# Altium project Power_Rail_Probe.PrjPcb
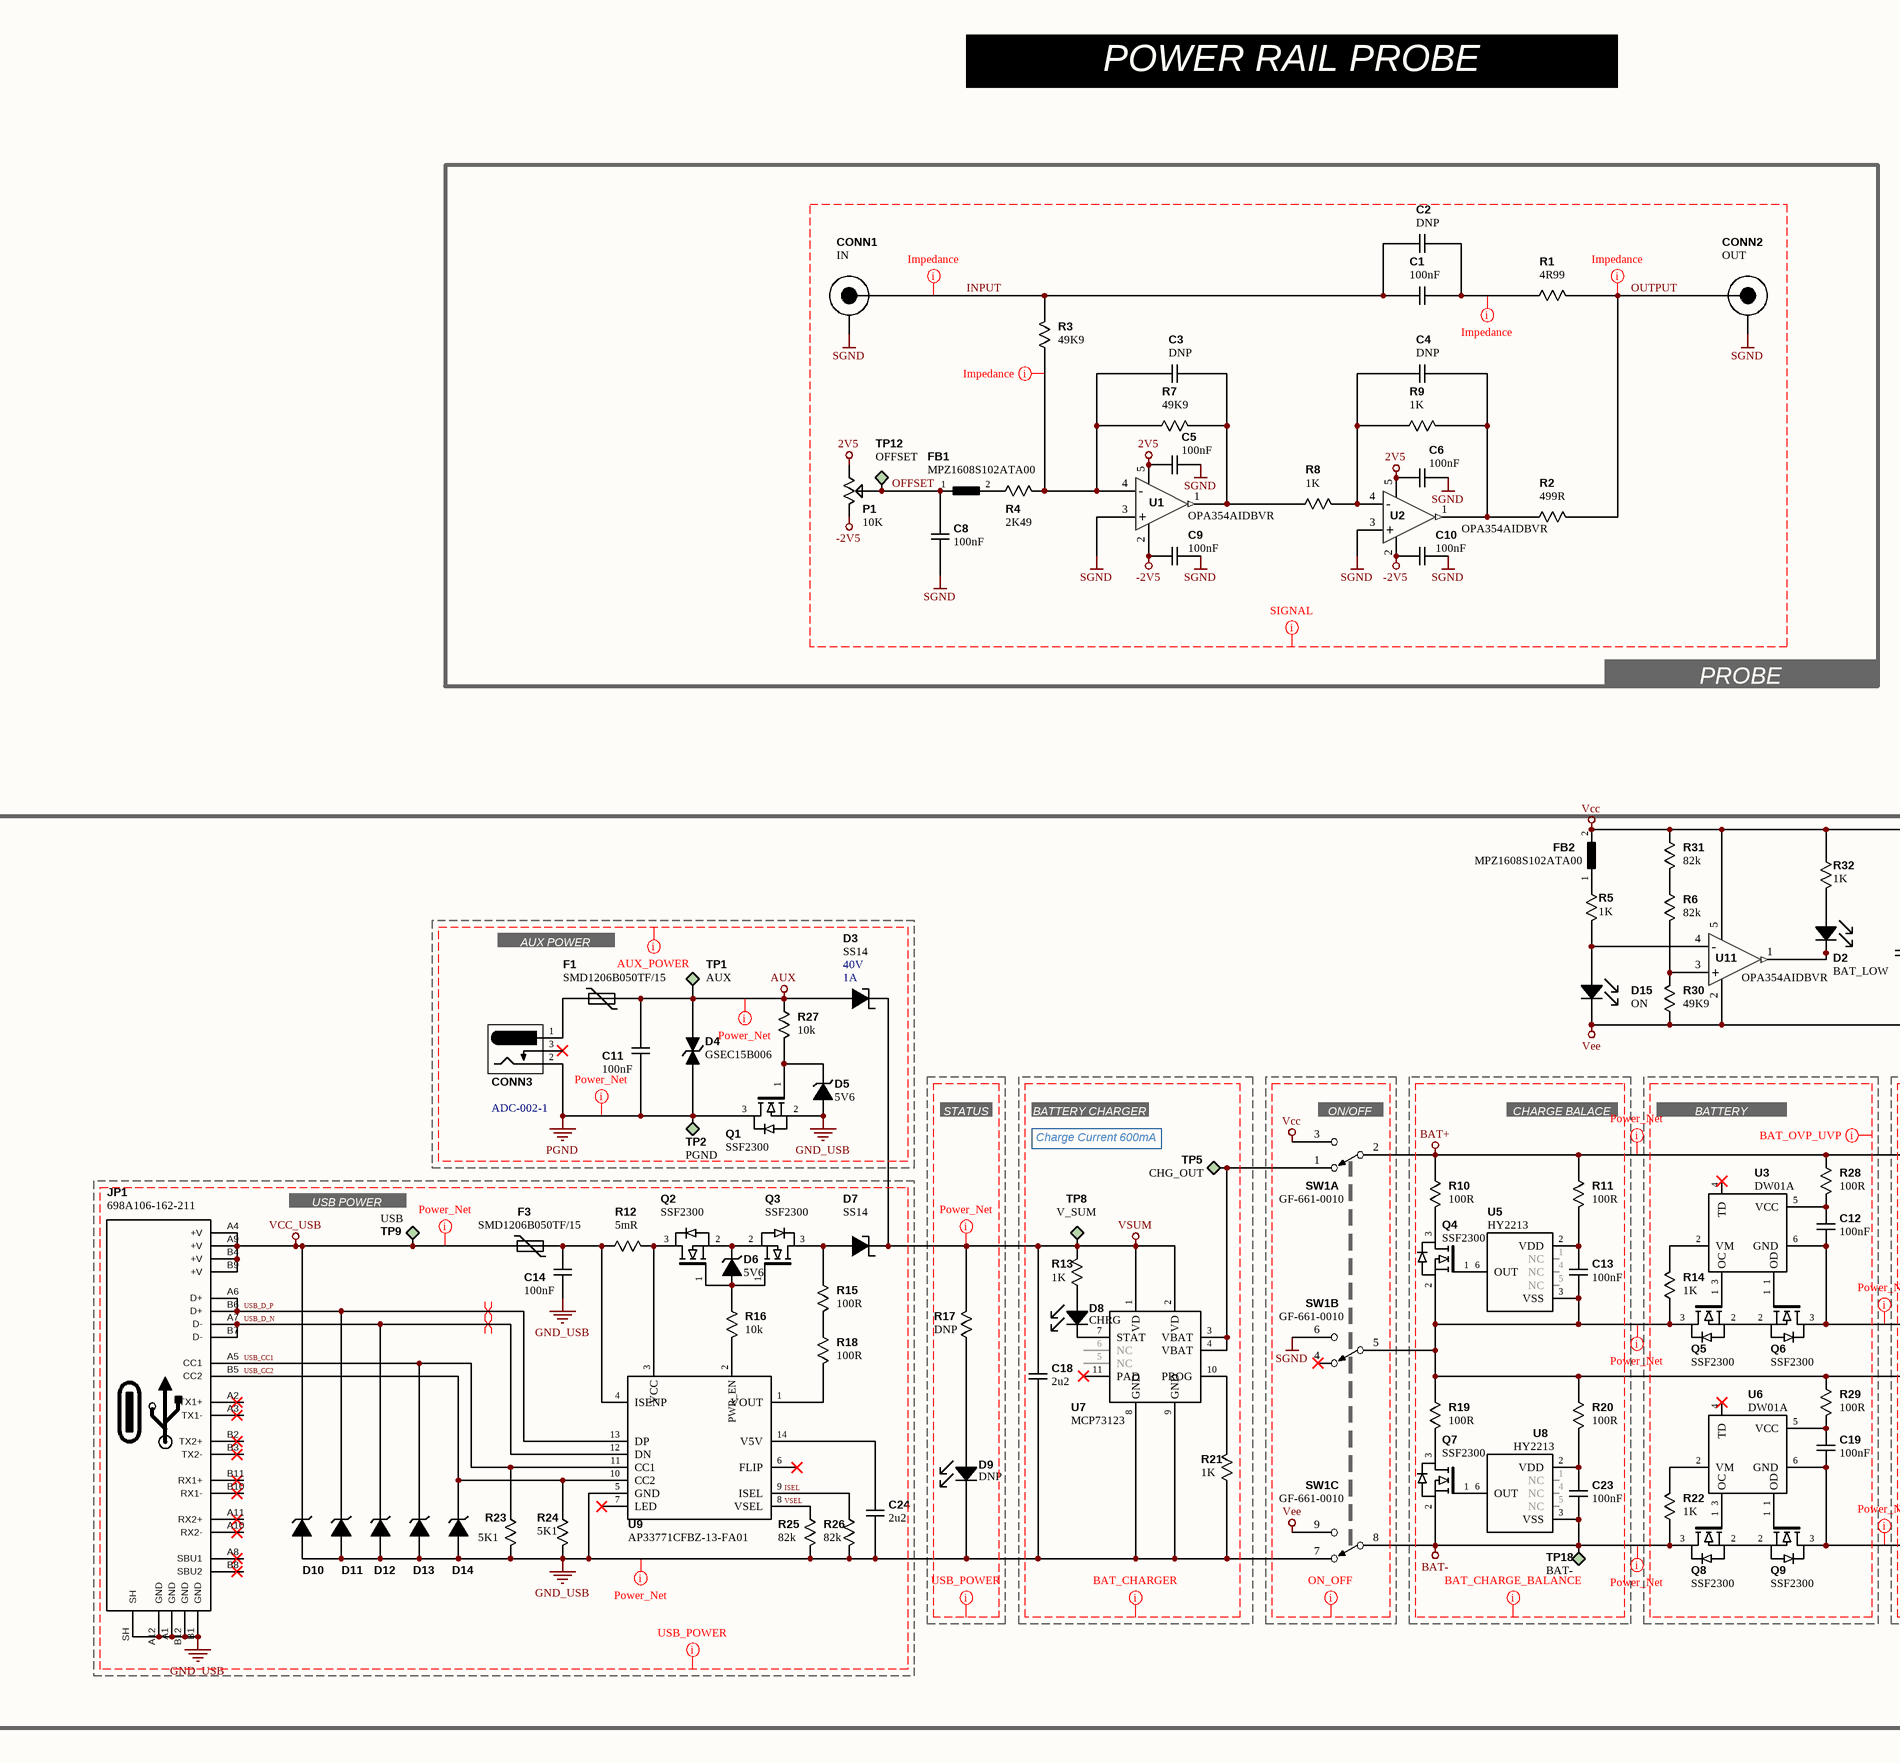
[diagram p0: Power_Rail_Probe.SchDoc, left]
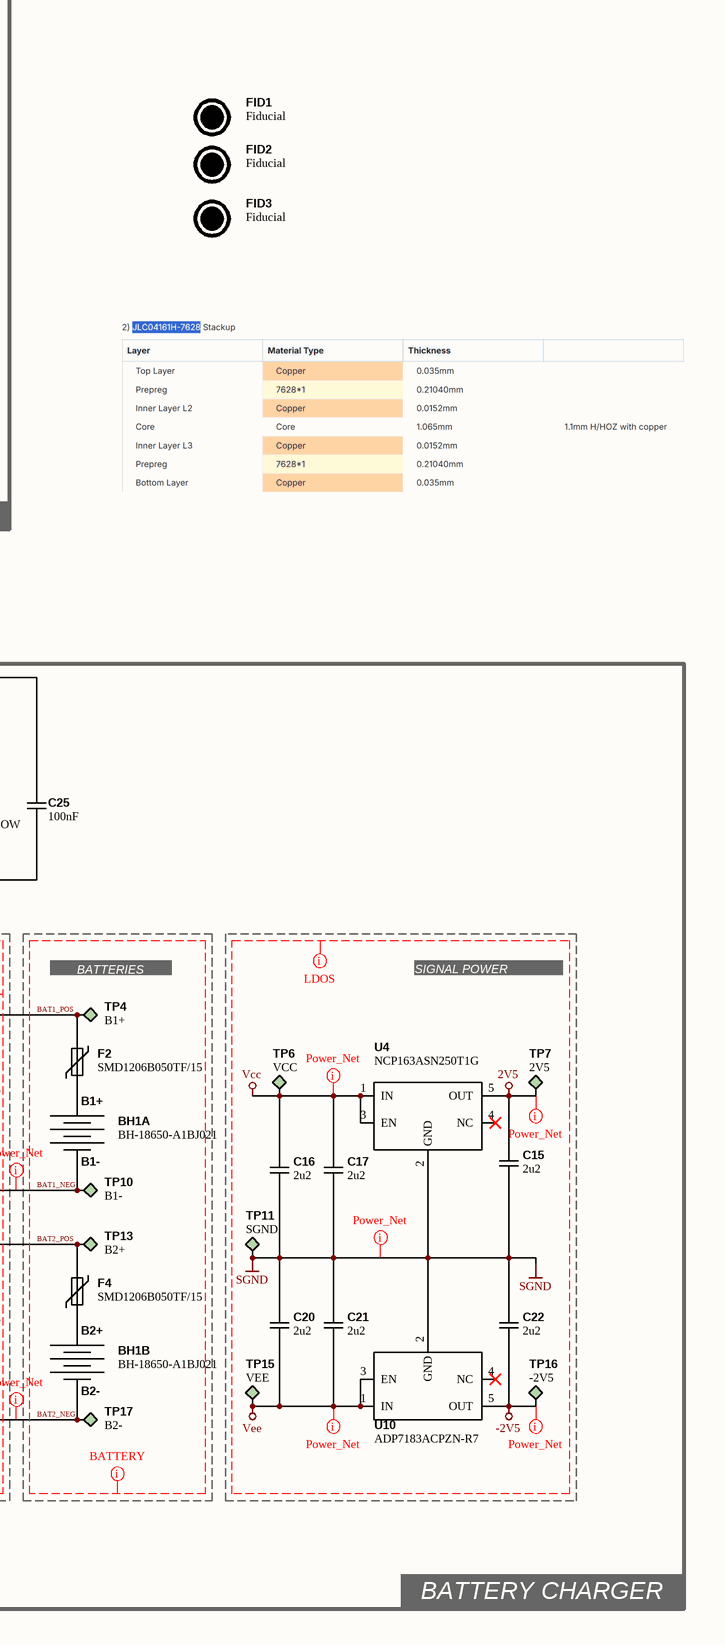
[diagram p1: Power_Rail_Probe.SchDoc, right]
1 sheet, 122 parts. Net scope: global (net labels, ports and power ports of the same name join across sheets).
Board file: Power_Rail_Probe.PcbDoc

## Sheet Power_Rail_Probe.SchDoc
size A2; SheetNumber: 1; SheetTotal: 1

### Parts
BH1  BH-18650-A1BJ021  [BH-18650-A1BJ021]  (parts A,B of 2)
C1  100nF  [CAP_SMD_1206]
C2  DNP  [CAP_SMD_0603]
C3  DNP  [CAP_SMD_0603]
C4  DNP  [CAP_SMD_0603]
C5  100nF  [CAP_SMD_0603]
C6  100nF  [CAP_SMD_0603]
C8  100nF  [CAP_SMD_0603]
C9  100nF  [CAP_SMD_0603]
C10  100nF  [CAP_SMD_0603]
C11  100nF  [CAP_SMD_0603]
C12  100nF  [CAP_SMD_0603]
C13  100nF  [CAP_SMD_0603]
C14  100nF  [CAP_SMD_0603]
C15  2u2  [CAP_SMD_0805]
C16  2u2  [CAP_SMD_0805]
C17  2u2  [CAP_SMD_0805]
C18  2u2  [CAP_SMD_0805]
C19  100nF  [CAP_SMD_0603]
C20  2u2  [CAP_SMD_0805]
C21  2u2  [CAP_SMD_0805]
C22  2u2  [CAP_SMD_0805]
C23  100nF  [CAP_SMD_0603]
C24  2u2  [CAP_SMD_0805]
C25  100nF  [CAP_SMD_0603]
CONN1  IN  [CONBNC002]
CONN2  OUT  [CONBNC002]
CONN3  04_Manufacturer Part Number: ADC-002-1  [ADC-002A]  (hidden comment: AUX)
D2  BAT_LOW  [LED_0603_1608]
D3  SS14  07_Tensión: 40V  08_Corriente: 1A  [DO_214_AC]
D4  GSEC15B006  [SOD_323]
D5  5V6  [SOD_323]
D6  5V6  [SOD_323]
D7  SS14  [DO_214_AC]
D8  CHRG  [LED_0603_1608]
D9  DNP  [LED_0603_1608]
D10  GSEC15B006  [SOD_323]  (value not drawn)
D11  GSEC15B006  [SOD_323]  (value not drawn)
D12  GSEC15B006  [SOD_323]  (value not drawn)
D13  GSEC15B006  [SOD_323]  (value not drawn)
D14  GSEC15B006  [SOD_323]  (value not drawn)
D15  ON  [LED_0603_1608]
F1  SMD1206B050TF/15  [RES_SMD_1210]
F2  SMD1206B050TF/15  [RES_SMD_1210]
F3  SMD1206B050TF/15  [RES_SMD_1210]
F4  SMD1206B050TF/15  [RES_SMD_1210]
FB1  MPZ1608S102ATA00  [FERRITE_SMD_0603]
FB2  MPZ1608S102ATA00  [FERRITE_SMD_0603]
FID1  Fiducial  [Fiducial]  (no BOM)
FID2  Fiducial  [Fiducial]  (no BOM)
FID3  Fiducial  [Fiducial]  (no BOM)
JP1  698A106-162-211  [1054500101]
P1  10K  [POTENCIOMETRO_RK09K1110A0J]
Q1  SSF2300  [SOT_23-3]
Q2  SSF2300  [SOT_23-3]
Q3  SSF2300  [SOT_23-3]
Q4  SSF2300  [SOT_23-3]
Q5  SSF2300  [SOT_23-3]
Q6  SSF2300  [SOT_23-3]
Q7  SSF2300  [SOT_23-3]
Q8  SSF2300  [SOT_23-3]
Q9  SSF2300  [SOT_23-3]
R1  4R99  [RES_SMD_0603]
R2  499R  [RES_SMD_0603]
R3  49K9  [RES_SMD_0603]
R4  2K49  [RES_SMD_0603]
R5  1K  [RES_SMD_0603]
R6  82k  [RES_SMD_0603]
R7  49K9  [RES_SMD_0603]
R8  1K  [RES_SMD_0603]
R9  1K  [RES_SMD_0603]
R10  100R  [RES_SMD_0603]
R11  100R  [RES_SMD_0603]
R12  5mR  [RES_SMD_0805]
R13  1K  [RES_SMD_0603]
R14  1K  [RES_SMD_0603]
R15  100R  [RES_SMD_0603]
R16  10k  [RES_SMD_0603]
R17  DNP  [RES_SMD_0603]
R18  100R  [RES_SMD_0603]
R19  100R  [RES_SMD_0603]
R20  100R  [RES_SMD_0603]
R21  1K  [RES_SMD_0603]
R22  1K  [RES_SMD_0603]
R23  5K1  [RES_SMD_0603]
R24  5K1  [RES_SMD_0603]
R25  82k  [RES_SMD_0603]
R26  82k  [RES_SMD_0603]
R27  10k  [RES_SMD_0603]
R28  100R  [RES_SMD_0603]
R29  100R  [RES_SMD_0603]
R30  49K9  [RES_SMD_0603]
R31  82k  [RES_SMD_0603]
R32  1K  [RES_SMD_0603]
SW1  GF-661-0010  [1003P1T2B1M2QEH]  (parts A,B,C of 3)
TP1  AUX  [Test_Point_THT]  (no BOM)
TP2  PGND  [Test_Point_THT]  (no BOM)
TP4  B1+  [Test_Point_SMD]  (no BOM)
TP5  CHG_OUT  [Test_Point_THT]  (no BOM)
TP6  VCC  [Test_Point_THT]  (no BOM)
TP7  2V5  [Test_Point_THT]  (no BOM)
TP8  V_SUM  [Test_Point_THT]  (no BOM)
TP9  USB  [Test_Point_THT]  (no BOM)
TP10  B1-  [Test_Point_SMD]  (no BOM)
TP11  SGND  [Test_Point_THT]  (no BOM)
TP12  OFFSET  [Test_Point_THT]  (no BOM)
TP13  B2+  [Test_Point_SMD]  (no BOM)
TP15  VEE  [Test_Point_THT]  (no BOM)
TP16  -2V5  [Test_Point_THT]  (no BOM)
TP17  B2-  [Test_Point_SMD]  (no BOM)
TP18  BAT-  [Test_Point_THT]  (no BOM)
U1  OPA354AIDBVR  [SOT_23-5]
U2  OPA354AIDBVR  [SOT_23-5]
U3  DW01A  [SOT_23-6]
U4  NCP163ASN250T1G  [SOT_23-5]
U5  HY2213  [SOT_23-6]
U6  DW01A  [SOT_23-6]
U7  MCP73123  [DFN_10]
U8  HY2213  [SOT_23-6]
U9  AP33771CFBZ-13-FA01  [DFN_14]
U10  ADP7183ACPZN-R7  [SOT_23-5]
U11  OPA354AIDBVR  [SOT_23-5]

### Nets
2V5: C5.1 C6.1 C15.2 P1.3 TP7.1 U1.5(VCC) U2.5(VCC) U4.5(OUT)
-2V5: C9.1 C10.1 C22.1 P1.1 TP16.1 U1.2(GND) U2.2(GND) U10.5(OUT)
AUX: C11.2 D3.A D4.K F1.1 R27.2 TP1.1
BAT1_POS: F2.2 R10.2 R11.2 R28.2 SW1.2(COM1) TP4.1  [also labelled BAT+]
BAT-: C23.1 Q7.2(S) Q8.3(D) R22.1 SW1.8(COM3) TP18.1 U8.3(VSS)
GND_USB: C14.1 C18.1 C24.1 D5.A D9.K D10.A D11.A D12.A D13.A D14.A JP1.A1(GND) JP1.A12(GND) JP1.B1(GND) JP1.B12(GND) JP1.SH Q1.2(S) R21.1 R23.1 R24.1 R25.1 R26.1 SW1.7(NC3) U7.8(GND) U7.9(GND) U9.5(GND)
PGND: C11.1 CONN3.2 D4.A Q1.3(D) TP2.1
SGND: C5.2 C6.2 C8.1 C9.2 C10.2 C15.1 C16.1 C17.1 C20.2 C21.2 C22.2 CONN1.2 CONN2.2 SW1.6(NO2) TP11.1 U1.3(+) U2.3(+) U4.2(GND) U10.2(GND)
Vcc: C16.2 C17.2 C25.1 FB2.2 R31.2 R32.1 SW1.3(NO1) TP6.1 U4.1(IN) U4.3(EN) U11.5(VCC)
VCC_USB: D10.K F3.2 JP1.A4(+V) JP1.A9(+V) JP1.B4(+V) JP1.B9(+V) TP9.1
Vee: C20.1 C21.1 C25.2 D15.K R30.1 SW1.9(NO3) TP15.1 U10.1(IN) U10.3(EN) U11.2(GND)
VSUM: C18.2 D3.K D7.K R13.2 R17.2 TP8.1 U7.1(VD) U7.2(VD)
BAT1_NEG: BH1.N1 C12.1 Q6.3(D) TP10.1 U3.6(GND)
BAT2_NEG: BH1.N2(B2-) C19.1 Q9.3(D) TP17.1 U6.6(GND)
BAT2_POS: C13.1 F4.2 Q4.2(S) Q5.3(D) R14.1 R19.2 R20.2 R29.2 SW1.5(COM2) TP13.1 U5.3(VSS)
INPUT: C1.1 C2.2 CONN1.1(SIGNAL) R3.2
OFFSET: C8.2 FB1.1 P1.2 TP12.1
OUTPUT: CONN2.1(SIGNAL) R1.2 R2.2
USB_CC1: D13.K JP1.A5(CC1) R23.2 U9.11(CC1)
USB_CC2: D14.K JP1.B5(CC2) R24.2 U9.10(CC2)
USB_D_N: D12.K JP1.A7(D-) JP1.B7(D-) U9.12(DN)
USB_D_P: D11.K JP1.A6(D+) JP1.B6(D+) U9.13(DP)
NetBH1_P1: BH1.P1(B+) F2.1
NetBH1_P2: BH1.P2(B2+) F4.1
NetC1_2: C1.2 C2.1 R1.1
NetC3_1: C3.1 R7.2 R8.1 U1.1(OUT)
NetC3_2: C3.2 R3.1 R4.2 R7.1 U1.4(-)
NetC4_1: C4.1 R2.1 R9.2 U2.1(OUT)
NetC4_2: C4.2 R8.2 R9.1 U2.4(-)
NetC12_2: C12.2 R28.1 U3.5(VCC)
NetC13_2: C13.2 R11.1 U5.2(VDD)
NetC14_2: C14.2 F3.1 R12.2 U9.4(ISENP)
NetC19_2: C19.2 R29.1 U6.5(VCC)
NetC23_2: C23.2 R20.1 U8.2(VDD)
NetC24_2: C24.2 U9.14(V5V)
NetCONN3_1: CONN3.1(SIGNAL) F1.2
NetD2_A: D2.A R32.2
NetD2_K: D2.K U11.1(OUT)
NetD5_K: D5.K Q1.1(G) R27.1
NetD6_A: D6.A Q2.1(G) Q3.1(G) R16.2
NetD6_K: D6.K Q2.2(S) Q3.2(S)
NetD7_A: D7.A Q3.3(D) R15.2
NetD8_A: D8.A R13.1
NetD8_K: D8.K U7.7(STAT)
NetD9_A: D9.A R17.1
NetD15_A: D15.A R5.2 U11.4(-)
NetFB1_2: FB1.2 R4.1
NetFB2_1: FB2.1 R5.1
NetQ2_3: Q2.3(D) R12.1 U9.3(VCC)
NetQ4_1: Q4.1(G) U5.6(OUT)
NetQ4_3: Q4.3(D) R10.1
NetQ5_1: Q5.1(G) U3.3(OC)
NetQ5_2: Q5.2(S) Q6.2(S)
NetQ6_1: Q6.1(G) U3.1(OD)
NetQ7_1: Q7.1(G) U8.6(OUT)
NetQ7_3: Q7.3(D) R19.1
NetQ8_1: Q8.1(G) U6.3(OC)
NetQ8_2: Q8.2(S) Q9.2(S)
NetQ9_1: Q9.1(G) U6.1(OD)
NetR6_1: R6.1 R30.2 U11.3(+)
NetR6_2: R6.2 R31.1
NetR14_2: R14.2 U3.2(VM)
NetR15_1: R15.1 R18.2
NetR16_1: R16.1 U9.2(PWR_EN)
NetR18_1: R18.1 U9.1(VOUT)
NetR21_2: R21.2 U7.10(PROG)
NetR22_2: R22.2 U6.2(VM)
NetR25_2: R25.2 U9.8(VSEL)
NetR26_2: R26.2 U9.9(ISEL)
NetSW1_1: SW1.1(NC1) TP5.1 U7.3(VBAT) U7.4(VBAT)

Not connected (* = marked no-connect by the designer): CONN3 3*; FID1 5; FID2 5; FID3 5; JP1 A2(TX1+)* A3(TX1-)* A8(SBU1)* A10(RX2-)* A11(RX2+)* B2(TX2+)* B3(TX2-)* B8(SBU2)* B10(RX1-)* B11(RX1+)*; SW1 4(NC2)*; U3 4(TD)*; U4 4(NC)*; U5 1(NC) 4(NC) 5(NC); U6 4(TD)*; U7 5(NC) 6(NC) 11(PAD)*; U8 1(NC) 4(NC) 5(NC); U9 6(FLIP)* 7(LED)*; U10 4(NC)*

### Layout directives
differential pair: USB_D_N, USB_D_P
CompClassName: AUX_POWER; net class AUX_POWER: AUX, GND_USB, PGND
CompClassName: USB_POWER; net class USB_POWER: (no net found under the mark), GND_USB, ISEL, USB_CC1, USB_CC2, USB_D_N, USB_D_P, VCC_USB, VSEL
CompClassName: BAT_CHARGER; net class BAT_CHARGER: VSUM
CompClassName: ON_OFF; net class ON_OFF: SGND, Vcc, Vee
CompClassName: BAT_CHARGE_BALANCE; net class BAT_CHARGE_BALANCE: BAT+, BAT-
CompClassName: BAT_OVP_UVP; net class BAT_OVP_UVP: (no net found under the mark)
CompClassName: BATTERY; net class BATTERY: BAT1_NEG, BAT1_POS, BAT2_NEG, BAT2_POS
CompClassName: LDOS; net class LDOS: 2V5, -2V5, SGND, Vcc, Vee
CompClassName: SIGNAL; net class SIGNAL: 2V5, -2V5, INPUT, OFFSET, OUTPUT, SGND
net class Power: 2V5, -2V5, AUX, BAT1_NEG, BAT1_POS, BAT2_NEG, BAT2_POS, BAT-, GND_USB, PGND, SGND, Vcc, VCC_USB, Vee, VSUM
net class 50_Ohm_Tracks: INPUT, NetC1_2, NetC3_2, OUTPUT

### Notes on the sheet
- POWER RAIL PROBE
- PROBE
- AUX POWER
- STATUS
- BATTERY CHARGER
- Charge Current 600mA
- (near SW1) ON/OFF
- CHARGE BALACE
- BATTERY PROTECTION
- (near TP4) BATTERIES
- SIGNAL POWER SUPPLIES
- (near TP9) USB POWER
- Labels drawn without touching a wire or pin: ISEL, VSEL
- (in symbol BH-18650-A1BJ021, part A) B1+; B1-

### Library data of the parts
BH1 = BH-18650-A1BJ021: 2 Cell 18650 Battery Holder; 06_Manufacturer: MYOUNG; 01_Componente: IC; 02_Montaje: THM; 03_Encapsulado: NA; 04_Manufacturer Part Number: BH-18650-A1BJ021; 05_Digikey Part Number: Not Available; 07_Funcion: Battery Holder; ComponentLink1Description: 01_Datasheet; ComponentLink1URL: https://www.lcsc.com/datasheet/C20606804.pdf?spm=wm.sxq.inf.ggs&lcsc_vid=QgdWXldRRVMIVlxRFlhXBFZfRldXX1JXQVQPBlEDEwUxVlNRQ1BfVVJRQ1VZVDsOAxUeFF5JWBYZEEoBGA4JCwFIFA4DSA%3D%3D; ComponentLink2Description: 02_Digikey; ComponentLink2URL: Not Available; ComponentLink3Description: 03_LCSC; ComponentLink3URL: https://www.lcsc.com/product-detail/C20606804.html
C1 = Capacitor NP: 0.1 µF ±2% 50V Ceramic Capacitor C0G, NP0 1206 (3216 Metric); 04_Manufacturer Part Number: GRM3195C1H104GA05D; 06_Manufacturer: YAGEO; 01_Componente: Capacitor cerámico; 02_Montaje: SMD; 03_Encapsulado: 1206; 09_Tensión de trabajo: 100V; 05_Digikey Part Number: 490-GRM3195C1H104GA05DCT-ND; ComponentLink1Description: A_Datasheet; ComponentLink1URL: https://search.murata.co.jp/Ceramy/image/img/A01X/G101/ENG/GRM3195C1H104GA05-01A.pdf; ComponentLink2Description: B_Digikey; ComponentLink2URL: https://www.digikey.com/en/products/detail/murata-electronics/GRM3195C1H104GA05D/13531987; 07_Valor: 100nF; 08_Tolerancia: 2%; 10_Dielectrico: C0G
C2-C4 = Capacitor NP: 0.1 µF ±10% 25V Ceramic Capacitor X7R 0603 (1608 Metric); 04_Manufacturer Part Number: CC0603KRX7R8BB104; 06_Manufacturer: YAGEO; 01_Componente: Capacitor cerámico; 02_Montaje: SMD; 03_Encapsulado: 0603; 07_Valor: 100nF; 05_Digikey Part Number: 311-1341-1-ND; ComponentLink1Description: A_Datasheet; ComponentLink2Description: B_Digikey; 08_Tolerancia: 10%; 09_Tensión de trabajo: 25V; 10_Dielectrico: X7R
  C2 C3: ComponentLink1URL: *; ComponentLink2URL: *
  C4: ComponentLink1URL: https://yageogroup.com/content/datasheet/asset/file/UPY-GPHC_X7R_6_3V-TO-250V; ComponentLink2URL: https://www.digikey.com/en/products/detail/yageo/CC0603KRX7R8BB104/2103079?s=N4IgTCBcDaIMJwAwDZEGYDSAlAGgdiwA4AhYgRkQBYQBdAXyA
C5 C6 C8-C14 C19 C23 C25 = Capacitor NP: 0.1 µF ±10% 25V Ceramic Capacitor X7R 0603 (1608 Metric); 04_Manufacturer Part Number: CC0603KRX7R8BB104; 06_Manufacturer: YAGEO; 01_Componente: Capacitor cerámico; 02_Montaje: SMD; 03_Encapsulado: 0603; 05_Digikey Part Number: 311-1341-1-ND; ComponentLink1Description: A_Datasheet; ComponentLink2Description: B_Digikey; 07_Valor: 100nF; 08_Tolerancia: 10%; 09_Tensión de trabajo: 25V; 10_Dielectrico: X7R
  C5: ComponentLink1URL: https://yageogroup.com/content/datasheet/asset/file/UPY-GPHC_X7R_6_3V-TO-250V; ComponentLink2URL: https://www.digikey.com/en/products/detail/yageo/CC0603KRX7R8BB104/2103079
  C6 C8-C14 C19 C23 C25: ComponentLink1URL: *; ComponentLink2URL: *
C15-C18 C20-C22 C24 = Capacitor NP: 2.2 µF ±10% 25V Ceramic Capacitor X7R 0805 (2012 Metric); 04_Manufacturer Part Number: GRM21BR71E225KE11K; 06_Manufacturer: Murata Electronics; 01_Componente: Capacitor cerámico; 02_Montaje: SMD; 03_Encapsulado: 0805; 05_Digikey Part Number: 490-GRM21BR71E225KE11KCT-ND; ComponentLink1Description: A_Datasheet; ComponentLink2Description: B_Digikey; 07_Valor: 2u2; 08_Tolerancia: 10%; 09_Tensión de trabajo: 25V; 10_Dielectrico: X7R
  C15-C17 C20-C22: ComponentLink1URL: *; ComponentLink2URL: *
  C18 C24: ComponentLink1URL: https://search.murata.co.jp/Ceramy/image/img/A01X/G101/ENG/GRM21BR71E225KE11-01A.pdf; ComponentLink2URL: https://www.digikey.com/en/products/detail/murata-electronics/GRM21BR71E225KE11K/10694460
CONN1 CONN2 = Conector BNC: BNC Connector Jack, Female Socket 50 Ohms Panel Mount, Through Hole, Right Angle Solder; 06_Manufacturer: TE Connectivity Linx; 02_Montaje: SMD; 07_Contactos: 2; 08_Impedancia: 50 Ohm; 01_Componente: Conector BNC; 03_Encapsulado: BNC; 04_Manufacturer Part Number: CONBNC002; 05_Digikey Part Number: 343-CONBNC002-ND; ComponentLink1Description: A_Datasheet; ComponentLink2Description: B_Digikey
  CONN1: ComponentLink1URL: https://www.te.com/commerce/DocumentDelivery/DDEController?Action=srchrtrv&DocNm=CONBNC002&DocType=Data+Sheet&DocLang=English&DocFormat=pdf&PartCntxt=CONBNC002; ComponentLink2URL: https://www.digikey.com/en/products/detail/te-connectivity-linx/CONBNC002/16013841
  CONN2: ComponentLink1URL: *; ComponentLink2URL: *
CONN3 = DC JACK: 06_Manufacturer: Adam Tech; 02_Montaje: THT; 07_Contactos: 3; 01_Componente: DC JACK; 03_Encapsulado: -; 05_Digikey Part Number: 2057-ADC-002-1-ND; ComponentLink1Description: A_Datasheet; ComponentLink1URL: https://app.adam-tech.com/products/download/data_sheet/203725/adc-002-x-data-sheet.pdf; ComponentLink2Description: B_Digikey; ComponentLink2URL: https://www.digikey.com/en/products/detail/adam-tech/ADC-002-1/21710741; 08_Paso: -
D2 D8 D9 D15 = Diodo LED: 04_Manufacturer Part Number: SML-D12U1WT86; 06_Manufacturer: Rohm Semiconductor; 02_Montaje: SMD; 03_Encapsulado: 1608; 01_Componente: Diodo Led; 05_Digikey Part Number: SML-D12U1WT86CT-ND; ComponentLink1Description: A_Datasheet; ComponentLink1URL: https://www.rohm.com/datasheet?p=SML-D12U1W&dist=Digi-key&media=referral&source=digi-key.com&campaign=Digi-key; ComponentLink2Description: B_Digikey; ComponentLink2URL: https://www.digikey.com/en/products/detail/rohm-semiconductor/SML-D12U1WT86/5843853
D3 = Diodo Schottky: Diode 40 V 1A Surface Mount DO-214AC (SMA); 04_Manufacturer Part Number: SS14-M3/5AT; 06_Manufacturer: Vishay General Semiconductor - Diodes Division; 02_Montaje: SMD; 01_Componente: Diodo Schottky; 03_Encapsulado: DO-214AC; 05_Digikey Part Number: SS14-M3/5ATGICT-ND; ComponentLink1Description: A_Datasheet; ComponentLink1URL: https://mm.digikey.com/Volume0/opasdata/d220001/medias/docus/661/SS12-SS16.pdf; ComponentLink2Description: B_Digikey; ComponentLink2URL: https://www.digikey.com/en/products/detail/vishay-general-semiconductor-diodes-division/SS14-M3-5AT/4872626?s=N4IgTCBcDaIMpwIwBYC0BZAzAegKwEEAVEAXQF8g
D4 = Diodo TVS Bidireccional: Diodo TVS; 06_Manufacturer: Good-Ark Semiconductor; 02_Montaje: SMD; 03_Encapsulado: SOD-323; 07_Tensión de trabajo: 15V; 01_Componente: Diodo TVS; 04_Manufacturer Part Number: GSEC15B006; 05_Digikey Part Number: 4786-GSEC15B006CT-ND; ComponentLink1Description: A_Datasheet; ComponentLink1URL: https://goodarksemi.com/docs/datasheets/esd_tvs/GSECxB006.pdf; ComponentLink2Description: B_Digikey; ComponentLink2URL: https://www.digikey.com/en/products/detail/good-ark-semiconductor/GSEC15B006/18667511
D5 D6 = Diodo Zener: 04_Manufacturer Part Number: BZT52C5V6S-7-F; 06_Manufacturer: Diodes Incorporated; 02_Montaje: SMD; 03_Encapsulado: SOD-323; 01_Componente: Diodo Zener; 05_Digikey Part Number: BZT52C5V6S-FDICT-ND; ComponentLink1Description: A_Datasheet; ComponentLink2Description: B_Digikey; 07_Tensión de trabajo: 5V6
  D5: ComponentLink1URL: https://mm.digikey.com/Volume0/opasdata/d220001/medias/docus/804/BZT52C2V0S-BZT52C39S.pdf; ComponentLink2URL: https://www.digikey.com/en/products/detail/diodes-incorporated/BZT52C5V6S-7-F/804868
  D6: ComponentLink1URL: *; ComponentLink2URL: *
D7 = Diodo Schottky: Diode 40 V 1A Surface Mount DO-214AC (SMA); 04_Manufacturer Part Number: SS14-M3/5AT; 06_Manufacturer: Vishay General Semiconductor - Diodes Division; 02_Montaje: SMD; 07_Tensión: 40V; 01_Componente: Diodo Schottky; 03_Encapsulado: DO-214AC; 05_Digikey Part Number: SS14-M3/5ATGICT-ND; ComponentLink1Description: A_Datasheet; ComponentLink1URL: *; ComponentLink2Description: B_Digikey; ComponentLink2URL: *; 08_Corriente: 1A
D10-D14 = Diodo TVS Unidireccional: Diodo TVS; 06_Manufacturer: Good-Ark Semiconductor; 02_Montaje: SMD; 03_Encapsulado: SOD-323; 07_Tensión de trabajo: 15V; 01_Componente: Diodo TVS; 04_Manufacturer Part Number: GSEC15B006; 05_Digikey Part Number: 4786-GSEC15B006CT-ND; ComponentLink1Description: A_Datasheet; ComponentLink2Description: B_Digikey
  D10-D13: ComponentLink1URL: *; ComponentLink2URL: *
  D14: ComponentLink1URL: https://goodarksemi.com/docs/datasheets/esd_tvs/GSECxB006.pdf; ComponentLink2URL: https://www.digikey.com/en/products/detail/good-ark-semiconductor/GSEC15B006/18667511
F1-F4 = Polyswitch: Polymeric PTC Resettable Fuse 15V 500 mA Ih Surface Mount 1206 (3216 Metric), Concave; 06_Manufacturer: YAGEO; 02_Montaje: Through Hole; 03_Encapsulado: 1206; 07_Valor: 500mA; 01_Componente: Polyswitch; 04_Manufacturer Part Number: SMD1206B050TF/15; 05_Digikey Part Number: 13-SMD1206B050TF/15CT-ND; ComponentLink1Description: A_Datasheet; ComponentLink2Description: B_Digikey
  F1 F3 F4: ComponentLink1URL: https://www.yageogroup.com/content/datasheet/asset/file/SMD1210_1; ComponentLink2URL: https://www.digikey.com/en/products/detail/yageo/SMD1210B075TF-24/15212934
  F2: ComponentLink1URL: https://www.yageo.com/upload/media/product/productsearch/datasheet/cpc/pptc/SMD1206_1.pdf; ComponentLink2URL: https://www.digikey.com/en/products/detail/yageo/SMD1206B050TF-15/13689651
FB1 FB2 = Ferrite Bead: 1 kOhms @ 100 MHz 1 Power Line Ferrite Bead 0603 (1608 Metric) 800mA 300mOhm; 06_Manufacturer: TDK Corporation; 02_Montaje: SMD; 03_Encapsulado: 0603; 07_Valor: 1k; 08_Frecuencia: 100 MHz; 01_Componente: Ferrite bead; 04_Manufacturer Part Number: MPZ1608S102ATA00; 05_Digikey Part Number: 445-MPZ1608S102ATA00CT-ND; ComponentLink1Description: A_Datasheet; ComponentLink1URL: https://product.tdk.com/en/system/files?file=dam/doc/product/emc/emc/beads/catalog/beads_commercial_power_mpz1608_en.pdf; ComponentLink2Description: B_Digikey; ComponentLink2URL: https://www.digikey.com/en/products/detail/tdk/MPZ1608S102ATA00/3078621
FID1-FID3 = Fiducial: Fiducial SMD; 01_Componente: Fiducial
JP1 = USB C 3.0: USB-C (USB TYPE-C) USB 3.2 Gen 2 (USB 3.1 Gen 2, Superspeed + (USB 3.1)) Receptacle Connector 24 (6+18 Dummy) Position Surface Mount, Right Angle; 06_Manufacturer: Molex; 01_Componente: Conector USB C; 02_Montaje: SMD; 03_Encapsulado: USB C; 07_Contactos: 24; 08_Paso: 0.50mm; 04_Manufacturer Part Number: 1054500101; 05_Digikey Part Number: WM12856CT-ND; ComponentLink1Description: A_Datasheet; ComponentLink1URL: https://files.edac.net/edac/content/698A/698A106-162-211%20-%20EDAC%20USB%20Connector.pdf; ComponentLink2Description: B_Digikey; ComponentLink2URL: https://www.digikey.com/en/products/detail/edac-inc/698A106-162-211/17186068
P1 = POTENCIÓMETRO: 10k Ohm 1 Gang Linear Through Hole Potentiometer 1.0 Turns Carbon 0.05W, 1/20W PC Pins; 04_Manufacturer Part Number: RK09K1110A0J; 06_Manufacturer: Alps Alpine; 01_Componente: Potenciometer; 02_Montaje: THT; 03_Encapsulado: -; 05_Digikey Part Number: 4809-RK09K1110A0J-ND; ComponentLink1Description: A_Datasheet; ComponentLink1URL: https://mm.digikey.com/Volume0/opasdata/d220001/medias/docus/6727/AlpsAlpine_3_4_2024_rk09k-3412491-1-9.pdf; ComponentLink2Description: B_Digikey; ComponentLink2URL: https://www.digikey.com/en/products/detail/alps-alpine/RK09K1110A0J/19529183; 07_Valor: 10K; 08_Tolerancia: -
Q1-Q9 = NMOS: N-Channel MOSFET SOT-23; 04_Manufacturer Part Number: AO3414A; 06_Manufacturer: UMW; 02_Montaje: SMD; 07_Tensión máxima: 20V; 08_Corriente máxima: 4.5A; 09_Potencia máxima: 1.3W; 01_Componente: NMOS; 03_Encapsulado: SOT-23; 05_Digikey Part Number: 4518-AO3414ACT-ND; ComponentLink1Description: A_Datasheet; ComponentLink2Description: B_Digikey
  Q1: ComponentLink1URL: https://mm.digikey.com/Volume0/opasdata/d220001/medias/docus/5022/AO3414A.pdf; ComponentLink2URL: https://www.digikey.com/en/products/detail/umw/AO3414A/17635259
  Q6: ComponentLink1URL: https://goodarksemi.com/docs/datasheets/mosfets/SSF2300.pdf; ComponentLink2URL: https://www.digikey.com/en/products/detail/good-ark-semiconductor/SSF2300/18648256
R1 = Resistor: 4.99 Ohms ±0.1% 0.1W, 1/10W Chip Resistor 0603 (1608 Metric) Thin Film; 04_Manufacturer Part Number: RT0603BRD074R99L; 06_Manufacturer: YAGEO; 02_Montaje: SMD; 03_Encapsulado: 0603; 01_Componente: Resistor; 05_Digikey Part Number: 13-RT0603BRD074R99LCT-ND; ComponentLink1Description: A_Datasheet; ComponentLink1URL: https://www.digikey.com/en/products/detail/yageo/RT0603BRD074R99L/7708336; ComponentLink2Description: B_Digikey; ComponentLink2URL: https://www.digikey.com/en/products/detail/yageo/RT0603BRD074R99L/7708336; 07_Valor: 4R99; 08_Tolerancia: 0.1%
R2 = Resistor: 499 Ohms ±0.1% 0.167W, 1/6W Chip Resistor 0603 (1608 Metric) Automotive AEC-Q200 Thin Film; 04_Manufacturer Part Number: RNCF0603BTE499R; 06_Manufacturer: Stackpole Electronics Inc; 02_Montaje: SMD; 03_Encapsulado: 0603; 01_Componente: Resistor; 05_Digikey Part Number: 738-RNCF0603BTE499RCT-ND; ComponentLink1Description: A_Datasheet; ComponentLink1URL: https://www.seielect.com/catalog/SEI-RNCF.pdf; ComponentLink2Description: B_Digikey; ComponentLink2URL: https://www.digikey.com/en/products/detail/stackpole-electronics-inc/RNCF0603BTE499R/1710134; 07_Valor: 499R; 08_Tolerancia: 0.1%
R3 R7 R30 = Resistor: 49.9 kOhms ±0.1% 0.167W, 1/6W Chip Resistor 0603 (1608 Metric) Automotive AEC-Q200 Thin Film; 04_Manufacturer Part Number: RNCF0603BTE49K9; 06_Manufacturer: Stackpole Electronics Inc; 02_Montaje: SMD; 03_Encapsulado: 0603; 01_Componente: Resistor; 05_Digikey Part Number: 738-RNCF0603BTE49K9CT-ND; ComponentLink1Description: A_Datasheet; ComponentLink2Description: B_Digikey; 07_Valor: 49K9; 08_Tolerancia: 0.1%
  R3 R30: ComponentLink1URL: https://www.seielect.com/catalog/SEI-RNCF.pdf; ComponentLink2URL: https://www.digikey.com/en/products/detail/stackpole-electronics-inc/RNCF0603BTE49K9/1710260
  R7: ComponentLink1URL: *; ComponentLink2URL: *
R4 = Resistor: 2.49 kOhms ±0.1% 0.167W, 1/6W Chip Resistor 0603 (1608 Metric) Automotive AEC-Q200 Thin Film; 04_Manufacturer Part Number: RNCF0603BKE2K49; 06_Manufacturer: Stackpole Electronics Inc; 02_Montaje: SMD; 03_Encapsulado: 0603; 01_Componente: Resistor; 05_Digikey Part Number: 738-RNCF0603BKE2K49CT-ND; ComponentLink1Description: A_Datasheet; ComponentLink1URL: https://www.seielect.com/catalog/SEI-RNCF.pdf; ComponentLink2Description: B_Digikey; ComponentLink2URL: https://www.digikey.com/en/products/detail/stackpole-electronics-inc/RNCF0603BKE2K49/1710046; 07_Valor: 2K49; 08_Tolerancia: 0.1%
R5 R8 R9 R13 R14 R21 R22 R32 = Resistor: 1 kOhms ±0.1% 0.167W, 1/6W Chip Resistor 0603 (1608 Metric) Automotive AEC-Q200 Thin Film; 04_Manufacturer Part Number: RNCF0603BTE1K00; 06_Manufacturer: Stackpole Electronics Inc; 02_Montaje: SMD; 03_Encapsulado: 0603; 01_Componente: Resistor; 05_Digikey Part Number: 738-RNCF0603BTE1K00CT-ND; ComponentLink1Description: A_Datasheet; ComponentLink2Description: B_Digikey; 07_Valor: 1k; 08_Tolerancia: 0.1%
  R5 R8 R13 R14 R21 R22 R32: ComponentLink1URL: https://www.seielect.com/catalog/SEI-RNCF.pdf; ComponentLink2URL: https://www.digikey.com/en/products/detail/stackpole-electronics-inc/RNCF0603BTE1K00/1710217
  R9: ComponentLink1URL: *; ComponentLink2URL: *
R6 R25 R26 R31 = Resistor: 82 kOhms ±1% 0.1W, 1/10W Chip Resistor 0603 (1608 Metric) Automotive AEC-Q200 Thick Film; 04_Manufacturer Part Number: RMCF0603FT82K0; 06_Manufacturer: Stackpole Electronics Inc; 02_Montaje: SMD; 03_Encapsulado: 0603; 01_Componente: Resistor; 05_Digikey Part Number: RMCF0603FT82K0CT-ND; ComponentLink1Description: A_Datasheet; ComponentLink2Description: B_Digikey; 07_Valor: 82k; 08_Tolerancia: 1%
  R6 R25 R31: ComponentLink1URL: https://www.seielect.com/catalog/SEI-RMCF_RMCP.pdf; ComponentLink2URL: https://www.digikey.com/en/products/detail/stackpole-electronics-inc/RMCF0603FT82K0/1760956
  R26: ComponentLink1URL: *; ComponentLink2URL: *
R10 R11 R15 R18-R20 R28 R29 = Resistor: 04_Manufacturer Part Number: RMCF0603FT100R; 06_Manufacturer: Stackpole Electronics Inc; 02_Montaje: SMD; 03_Encapsulado: 0603; 08_Tolerancia: 1%; 01_Componente: Resistor; 05_Digikey Part Number: RMCF0603FT100RCT-ND; ComponentLink1Description: A_Datasheet; ComponentLink1URL: https://www.seielect.com/catalog/SEI-RMCF_RMCP.pdf; ComponentLink2Description: B_Digikey; ComponentLink2URL: https://www.digikey.com/en/products/detail/stackpole-electronics-inc/RMCF0603FT100R/1761113; 07_Valor: 100R
R12 = Resistor: 5 mOhms ±1% 0.125W, 1/8W Chip Resistor 0805 (2012 Metric) Current Sense Metal Foil; 04_Manufacturer Part Number: PE0805FRM070R005Z; 06_Manufacturer: YAGEO; 02_Montaje: SMD; 03_Encapsulado: 0805; 01_Componente: Resistor; 05_Digikey Part Number: 13-PE0805FRM070R005ZCT-ND; ComponentLink1Description: A_Datasheet; ComponentLink1URL: https://mm.digikey.com/Volume0/opasdata/d220001/medias/docus/5343/PE_Series_DS.pdf; ComponentLink2Description: B_Digikey; ComponentLink2URL: https://www.digikey.com/en/products/detail/yageo/PE0805FRM070R005Z/16992204; 07_Valor: 5mR; 08_Tolerancia: 1%
R16 R27 = Resistor: 10 kOhms ±1% 0.1W, 1/10W Chip Resistor 0603 (1608 Metric) Automotive AEC-Q200 Thick Film; 04_Manufacturer Part Number: RMCF0603FT10K0; 06_Manufacturer: Stackpole Electronics Inc; 02_Montaje: SMD; 03_Encapsulado: 0603; 01_Componente: Resistor; 05_Digikey Part Number: RMCF0603FT10K0CT-ND; ComponentLink1Description: A_Datasheet; ComponentLink2Description: B_Digikey; 07_Valor: 10k; 08_Tolerancia: 1%
  R16: ComponentLink1URL: *; ComponentLink2URL: *
  R27: ComponentLink1URL: https://www.seielect.com/catalog/SEI-RMCF_RMCP.pdf; ComponentLink2URL: https://www.digikey.com/en/products/detail/stackpole-electronics-inc/RMCF0603FT10K0/1761235
R17 = Resistor: 1 kOhms ±0.1% 0.167W, 1/6W Chip Resistor 0603 (1608 Metric) Automotive AEC-Q200 Thin Film; 04_Manufacturer Part Number: RNCF0603BTE1K00; 06_Manufacturer: Stackpole Electronics Inc; 02_Montaje: SMD; 03_Encapsulado: 0603; 07_Valor: 1k; 01_Componente: Resistor; 05_Digikey Part Number: 738-RNCF0603BTE1K00CT-ND; ComponentLink1Description: A_Datasheet; ComponentLink1URL: https://www.seielect.com/catalog/SEI-RNCF.pdf; ComponentLink2Description: B_Digikey; ComponentLink2URL: https://www.digikey.com/en/products/detail/stackpole-electronics-inc/RNCF0603BTE1K00/1710217; 08_Tolerancia: 0.1%
R23 R24 = Resistor: 5.1 kOhms ±1% 0.1W, 1/10W Chip Resistor 0603 (1608 Metric) Automotive AEC-Q200 Thick Film; 04_Manufacturer Part Number: RMCF0603FT5K10; 06_Manufacturer: Stackpole Electronics Inc; 02_Montaje: SMD; 03_Encapsulado: 0603; 01_Componente: Resistor; 05_Digikey Part Number: RMCF0603FT5K10CT-ND; ComponentLink1Description: A_Datasheet; ComponentLink2Description: B_Digikey; 07_Valor: 5k1; 08_Tolerancia: 1%
  R23: ComponentLink1URL: https://www.seielect.com/catalog/SEI-RMCF_RMCP.pdf; ComponentLink2URL: https://www.digikey.com/en/products/detail/stackpole-electronics-inc/RMCF0603FT5K10/1760908
  R24: ComponentLink1URL: *; ComponentLink2URL: *
SW1 = Interruptor 3PDT: Slide Switch 3PDT Through Hole; 04_Manufacturer Part Number: 1003P1T1B1M2QEH; 06_Manufacturer: CW Industries; 02_Montaje: THT; 03_Encapsulado: NA; 01_Componente: Switch; 05_Digikey Part Number: EG2425-ND; ComponentLink1Description: 01_Digikey; ComponentLink1URL: https://www.digikey.com/en/products/detail/e-switch/1003P1T1B1M2QEH/378894; ComponentLink2Description: 02_Datasheet; ComponentLink2URL: https://configured-product-images.s3.amazonaws.com/Datasheets/100.pdf
TP1 TP2 TP4-TP13 TP15-TP18 = TestPoint_SMD: Testpoint; 01_Componente: Test_Point; 02_Montaje: THT; 03_Encapsulado: NA; 04_Manufacturer Part Number: NA; 05_Digikey Part Number: NA; ComponentLink1Description: A_Datasheet; ComponentLink1URL: NA; ComponentLink2Description: B_Digikey; ComponentLink2URL: NA
U1 U2 U11 = OPA354: Voltage Feedback Amplifier 1 Circuit Rail-to-Rail SOT-23-5; 06_Manufacturer: Texas Instruments; 02_Montaje: SMD; 03_Encapsulado: SOIC_8; 01_Componente: OPA354AIDBVR; 04_Manufacturer Part Number: OPA354AIDBVR; 05_Digikey Part Number: 296-26279-1-ND; ComponentLink1Description: A_Datasheet; ComponentLink1URL: https://www.ti.com/general/docs/suppproductinfo.tsp?distId=10&gotoUrl=https%3A%2F%2Fwww.ti.com%2Flit%2Fgpn%2Fopa354; ComponentLink2Description: B_Digikey; ComponentLink2URL: https://www.digikey.com/en/products/detail/texas-instruments/OPA354AIDBVR/1572536
U3 U6 = DW01A: Battery Battery Protection IC Lithium Ion SOT-23-6; 04_Manufacturer Part Number: DW01; 06_Manufacturer: Shenzhen Slkormicro Semicon Co., Ltd.; 02_Montaje: SMD; 07_Funcion: Protector 1S; 01_Componente: IC; 03_Encapsulado: SOT_23-6; 05_Digikey Part Number: 5399-DW01CT-ND; ComponentLink1Description: 01_Datasheet; ComponentLink1URL: https://mm.digikey.com/Volume0/opasdata/d220001/medias/docus/6808/DW01%20SOT-23-6.PDF; ComponentLink2Description: 02_Digikey; ComponentLink2URL: https://www.digikey.com/en/products/detail/shenzhen-slkormicro-semicon-co-ltd/DW01/26601036
U4 = NCP163ASN250T1G: LDO Fixed 2V5 250mA Ultra-Low Noise SOT-23-5; 06_Manufacturer: Texas Instruments; 02_Montaje: SMD; 07_Tensión nominal: 3V3; 08_Corriente de salida: 300 mA; 09_Potencia de salida: 1W; 01_Componente: LDO; 03_Encapsulado: SOT_23-5; 04_Manufacturer Part Number: NCP163ASN250T1G; 05_Digikey Part Number: 488-NCP163ASN250T1GCT-ND; ComponentLink1Description: A_Datasheet; ComponentLink1URL: https://www.onsemi.com/pdf/datasheet/ncp163-d.pdf; ComponentLink2Description: B_Digikey; ComponentLink2URL: https://www.digikey.com/es/products/detail/onsemi/NCP163ASN250T1G/9694659
U5 U8 = HY2213: Balanceador de carga; 06_Manufacturer: Hycon Technology; 01_Componente: IC; 02_Montaje: SMD; 03_Encapsulado: SOT_23-6; 04_Manufacturer Part Number: HY2213; 05_Digikey Part Number: NE; 07_Funcion: Balanceador de carga; ComponentLink1Description: 01_Datasheet; ComponentLink1URL: https://www.hycontek.com/hy_battery/DS-HY2213_EN.pdf; ComponentLink2Description: 02_Digikey; ComponentLink2URL: NE
U7 = MCP73123: Battery Charger IC; 04_Manufacturer Part Number: MCP73213T-A6SI/MF; 06_Manufacturer: Microchip Technology; 01_Componente: Cargador de batería; 02_Montaje: SMD; 03_Encapsulado: DFN-10; 05_Digikey Part Number: MCP73213T-A6SI/MFCT-ND; ComponentLink1Description: Datasheet; ComponentLink1URL: https://ww1.microchip.com/downloads/en/devicedoc/20002190c.pdf; ComponentLink2Description: Digikey; ComponentLink2URL: https://www.digikey.com/en/products/detail/microchip-technology/MCP73213T-A6SI-MF/2126117
U9 = AP33771C: USB, Type-C Controller PMIC W-DFN3030-14 (Type A1); 06_Manufacturer: Microchip Technology; 01_Componente: Controlador USB-C; 02_Montaje: SMD; 03_Encapsulado: W-DFN3030-14; 04_Manufacturer Part Number: AP33771CFBZ-13-FA01; 05_Digikey Part Number: 31-AP33771CFBZ-13-FA01CT-ND; ComponentLink1Description: Datasheet; ComponentLink1URL: https://www.diodes.com/datasheet/download/AP33771C.pdf; ComponentLink2Description: Digikey; ComponentLink2URL: https://www.digikey.com/en/products/detail/diodes-incorporated/AP33771CFBZ-13-FA01/24384228?s=N4IgjCBcpgnAHLKoDGUBmBDANgZwKYA0IA9lANogAMIAugL7EC0ArMiGpFnkaRSACY69RoP4BBAAoBmaQHY5EWsQBs7AJYATKCCZgqEYgAcALjpDETATyP4dmXGhFA
U10 = ADP7183ACPZN-R7: LDO Fixed -2V5 250mA Ultra-Low Noise SOT-23-5; 06_Manufacturer: Texas Instruments; 02_Montaje: SMD; 07_Tensión nominal: 3V3; 08_Corriente de salida: 300 mA; 09_Potencia de salida: 1W; 01_Componente: LDO; 03_Encapsulado: SOT_23-5; 04_Manufacturer Part Number: ADP7183ACPZN-R7; 05_Digikey Part Number: 505-ADP7183ACPZN-R7CT-ND; ComponentLink1Description: A_Datasheet; ComponentLink1URL: https://www.onsemi.com/pdf/datasheet/ncp163-d.pdf; ComponentLink2Description: B_Digikey; ComponentLink2URL: https://www.analog.com/media/en/technical-documentation/data-sheets/ADP7183.pdf